# Altium schematic sheet IO_v31.SchDoc: AMF CONTROLLER GC12
size A4; Date: NOV 2011; DrawnBy: SURAJ; Engineer: SURAJ K A; Revision: 310; SheetNumber: 2; SheetTotal: 2
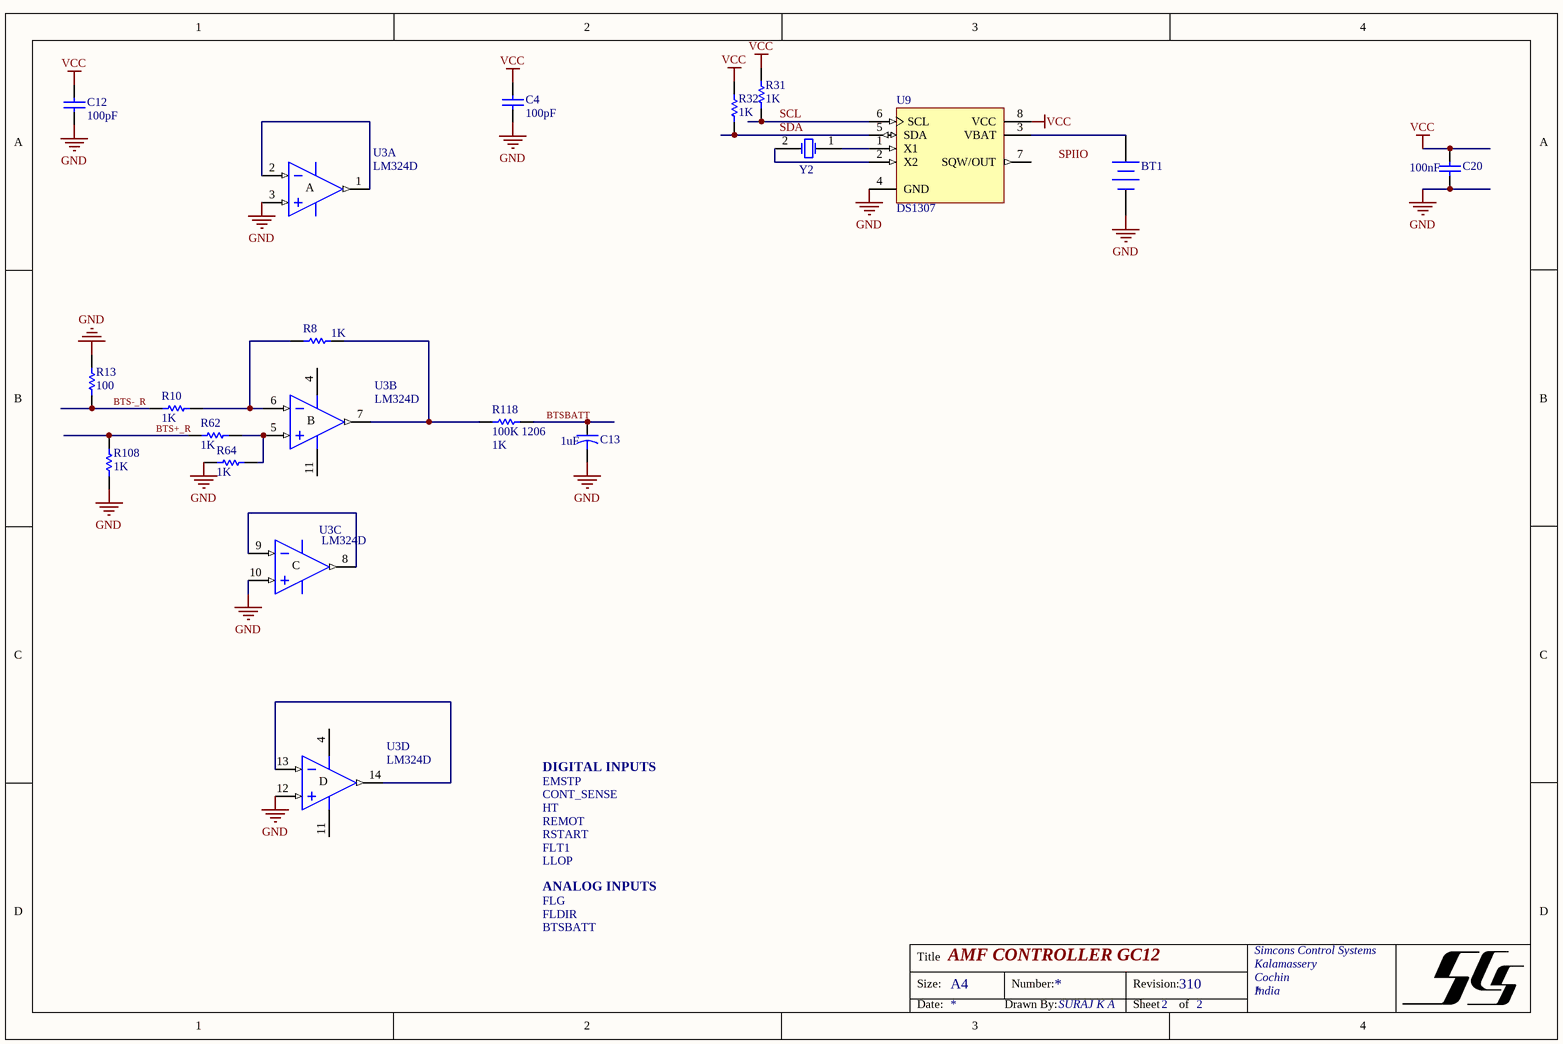
[diagram p0: IO_v31.SchDoc]

## Parts
BT1  CR2032  [CELL_HOLDER]  (value not drawn)
C4  value 100pF  [C1206_W]  (hidden comment: .1uF 1206)
C12  value 100pF  [C1206_W]  (hidden comment: .1uF 1206)
C13  value 1uF  [C1206_W]  (hidden comment: .1uF 1206)
C20  value 100nF  [C1206_W]  (hidden comment: .1uF 1206)
R8  value 1K  [R1206_W]  (hidden comment: 1M 1206)
R10  value 1K  [R1206_W]  (hidden comment: 1M 1206)
R13  value 100  [R1206_W]  (hidden comment: 47K 1206)
R31  value 1K  [R1206_W]  (hidden comment: 4.7K 1206)
R32  value 1K  [R1206_W]  (hidden comment: 4.7K 1206)
R62  value 1K  [R1206_W]  (hidden comment: 1M 1206)
R64  value 1K  [R1206_W]  (hidden comment: 1M 1206)
R108  value 1K  [R1206_W]  (hidden comment: 47K 1206)
R118  100K 1206  value 1K  [R1206_W]
U3  LM324D  [SOIC14_M]  (parts A,B,C,D of 4)
U9  DS1307  [DIP-8]
Y2  XTAL 32.768KHz 6pF  [XTALWATCH]  (value not drawn)

## Nets
GND: BT1.2(-) C4.1 C12.1 C13.2 C20.1 R13.1 R64.1 R108.1 U3.3(IN+) U3.10(IN+) U3.11(V-) U3.12(IN+) U9.4(GND)
VCC: C4.2 C12.2 C20.2 R31.1 R32.1 U3.4(V+) U9.8(VCC)
BTS+_R: R62.1 R108.2
BTS-_R: R10.1 R13.2
BTSBATT: C13.1 R118.2
SCL: R31.2 U9.6(SCL)
SDA: R32.2 U9.5(SDA)
NetBT1_1: BT1.1(+) U9.3(VBAT)
NetR8_1: R8.1 R10.2 U3.6(IN-)
NetR8_2: R8.2 R118.1 U3.7(OUT)
NetR62_2: R62.2 R64.2 U3.5(IN+)
NetU3_1: U3.1(OUT) U3.2(IN-)
NetU3_8: U3.8(OUT) U3.9(IN-)
NetU3_13: U3.13(IN-) U3.14(OUT)
NetU9_1: U9.1(X1) Y2.1(OSC1)
NetU9_2: U9.2(X2) Y2.2(OSC2)

Not connected (* = marked no-connect by the designer): U9 7(SQW/OUT)

## Notes on the sheet
- DIGITAL INPUTS
- EMSTP
- CONT_SENSE
- HT
- REMOT
- RSTART
- FLT1
- LLOP
- ANALOG INPUTS
- FLG
- FLDIR
- BTSBATT
- Labels drawn without touching a wire or pin: SPIIO
- Title
- Size:
- A4
- Number:
- Revision:
- Simcons Control Systems
- Kalamassery
- Cochin
- India
- Date:
- Drawn By:
- SURAJ K A
- Sheet
- of
- (in symbol LM324D, part A) A
- (in symbol LM324D, part B) B
- (in symbol LM324D, part C) C
- (in symbol LM324D, part D) D

## Library data of the parts
BT1 = Battery: Multicell Battery; Published: 24-Mar-1999; LatestRevisionDate: 17-Jul-2002; LatestRevisionNote: Re-released for DXP Platform.; PackageReference: BAT-2; Publisher: Altium Limited; PackageDescription: Battery; 2 Leads
C4 C12 C20 = Cap: Capacitor; Published: 8-Jun-2000; LatestRevisionDate: 17-Jul-2002; LatestRevisionNote: Re-released for DXP Platform.; PackageReference: RAD-0.3; Publisher: Altium Limited; PackageDescription: Radial Cap, Thru-Hole; 2 Leads; 0.3 in Pin Spacing
C13 = Cap2: Capacitor; Published: 23-Sep-2002; PackageReference: CAPR5-4X5; Publisher: Altium Limited; PackageDescription: Capacitor; 2 Leads
R8 R10 R13 R31 R32 R62 R64 R108 = Res1: Resistor; Published: 8-Jun-2000; LatestRevisionDate: 17-Jul-2002; LatestRevisionNote: Re-released for DXP Platform.; PackageReference: AXIAL-0.3; Publisher: Altium Limited; PackageDescription: Axial Device, Thru-Hole; 2 Leads; 0.3 in Pin Spacing
R118 = Res Semi: Semiconductor Resistor; Published: 8-Jun-2000; LatestRevisionDate: 17-Jul-2002; LatestRevisionNote: Re-released for DXP Platform.; PackageReference: AXIAL-0.5; Publisher: Altium Limited; PackageDescription: Axial Device, Thru-Hole; 2 Leads; 0.5 in Pin Spacing
U3 = LM324D: Quadruple Operational Amplifier; Published: 16-Jan-2001; LatestRevisionDate: 13-Apr-2006; LatestRevisionNote: IPC-7351 Footprint Added.; DatasheetVersion: Feb-1997; PackageVersion: Jan-1998; PackageReference: D014; Publisher: Altium Limited; PackageDescription: 14-Pin Small Outline Integrated Circuit 1.27 mm Pitch; Code_IPC: SOIC127P600-14; ComponentLink1Description: Manufacturer Link; ComponentLink1URL: http://www.ti.com/; ComponentLink2Description: Datasheet; ComponentLink2URL: http://www-s.ti.com/sc/ds/lm324.pdf
U9 = DS1307: 64 X 8 Serial Real-Time Clock; Published: 13-Oct-2000; LatestRevisionDate: 17-Jul-2002; LatestRevisionNote: Re-released for DXP Platform.; DatasheetVersion: 10-Aug-1999; PackageVersion: 1999; PackageReference: DIP8; Publisher: Altium Limited; PackageDescription: DIP, 8-Pin, Row Spacing 7.62 mm, Pitch 2.54 mm; ComponentLink1Description: Manufacturer Link; ComponentLink1URL: http://www.maxim-ic.com/; ComponentLink2Description: Datasheet; ComponentLink2URL: http://pdfserv.maxim-ic.com/en/ds/DS1307.pdf; ComponentLink3Description: Discontinuation Notice; ComponentLink3URL: http://www.maxim-ic.com/qa/pdfs/non-obsolescence-letter.pdf
Y2 = XTAL: Crystal Oscillator; Published: 8-Jun-2000; LatestRevisionDate: 17-Jul-2002; LatestRevisionNote: Re-released for DXP Platform.; PackageReference: R38; Publisher: Altium Limited; PackageDescription: Crystal, Thru-Hole; 2 Leads; Body 3.1 x 8.2 mm (Dia.xH)